# EAGLE design 3.3-5V Signal (EAGLE 9.6.2)
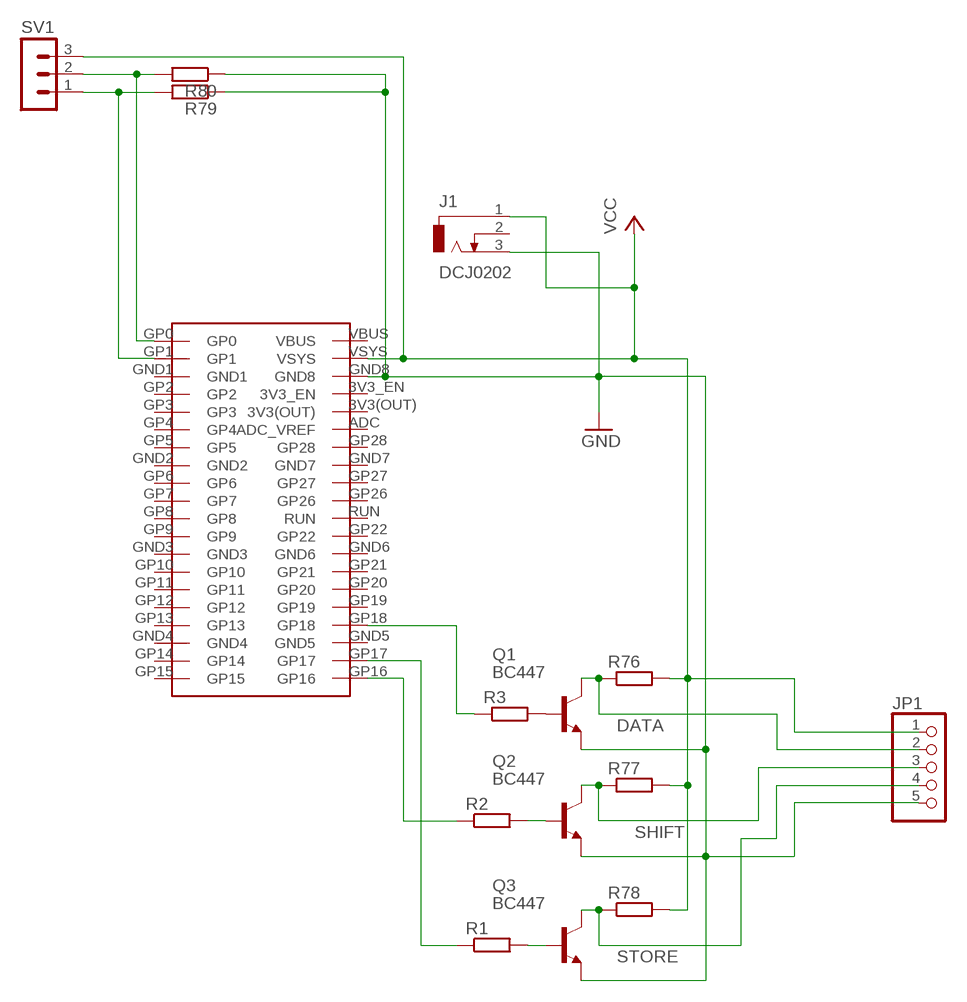
[diagram p0: schematic, sheet 1]

## Parts
J1  DCJ0202  [DCJ0202]
JP1  PINHD-1X5  [1X05]
Q1  BC447  [TO92-EBC]
Q2  BC447  [TO92-EBC]
Q3  BC447  [TO92-EBC]
R1  R-EU_0207/10  [0207/10]
R2  R-EU_0207/10  [0207/10]
R3  R-EU_0207/10  [0207/10]
R76  R-EU_0207/10  [0207/10]
R77  R-EU_0207/10  [0207/10]
R78  R-EU_0207/10  [0207/10]
R79  R-EU_0207/10  [0207/10]
R80  R-EU_0207/10  [0207/10]
SV1  MA03-1  [MA03-1]
U$2  PI_PICO  [PI_PICO]

## Nets
DATA: JP1.2 Q1.C R76.1
GND: J1.3 JP1.5 Q1.E Q2.E Q3.E R79.1 R80.1 U$2.GND8
N$1: R1.1 U$2.GP17
N$2: Q3.B R1.2
N$4: Q2.B R2.2
N$5: Q1.B R3.2
N$6: R3.1 U$2.GP18
N$7: R2.1 U$2.GP16
N$41: R80.2 SV1.2 U$2.GP0
N$43: R79.2 SV1.1 U$2.GP1
SHIFT: JP1.3 Q2.C R77.1
STORE: JP1.4 Q3.C R78.1
VCC: J1.1 JP1.1 R76.2 R77.2 R78.2 SV1.3 U$2.VSYS
Unconnected: J1.2 U$2.3V3(OUT) U$2.3V3_EN U$2.ADC(ADC_VREF) U$2.GND1 U$2.GND2 U$2.GND3 U$2.GND4 U$2.GND5 U$2.GND6 U$2.GND7 U$2.GP2 U$2.GP3 U$2.GP4 U$2.GP5 U$2.GP6 U$2.GP7 U$2.GP8 U$2.GP9 U$2.GP10 U$2.GP11 U$2.GP12 U$2.GP13 U$2.GP14 U$2.GP15 U$2.GP19 U$2.GP20 U$2.GP21 U$2.GP22 U$2.GP26 U$2.GP27 U$2.GP28 U$2.RUN U$2.VBUS

## Library data of the parts
J1 = con-jack:DCJ0202: DC POWER JACK Source: DCJ0202.pdf; OC_FARNELL: unknown; OC_NEWARK: unknown
JP1 = pinhead:PINHD-1X5: PIN HEADER
Q1-Q3 = transistor-npn:BC447*: NPN Transistor
R1-R3 R76-R80 = rcl:R-EU_: RESISTOR, European symbol; SPICEPREFIX: R
SV1 = con-lstb:MA03-1: PIN HEADER; OC_FARNELL: unknown; OC_NEWARK: unknown
U$2 = PI_PICO:PI_PICO

## Board
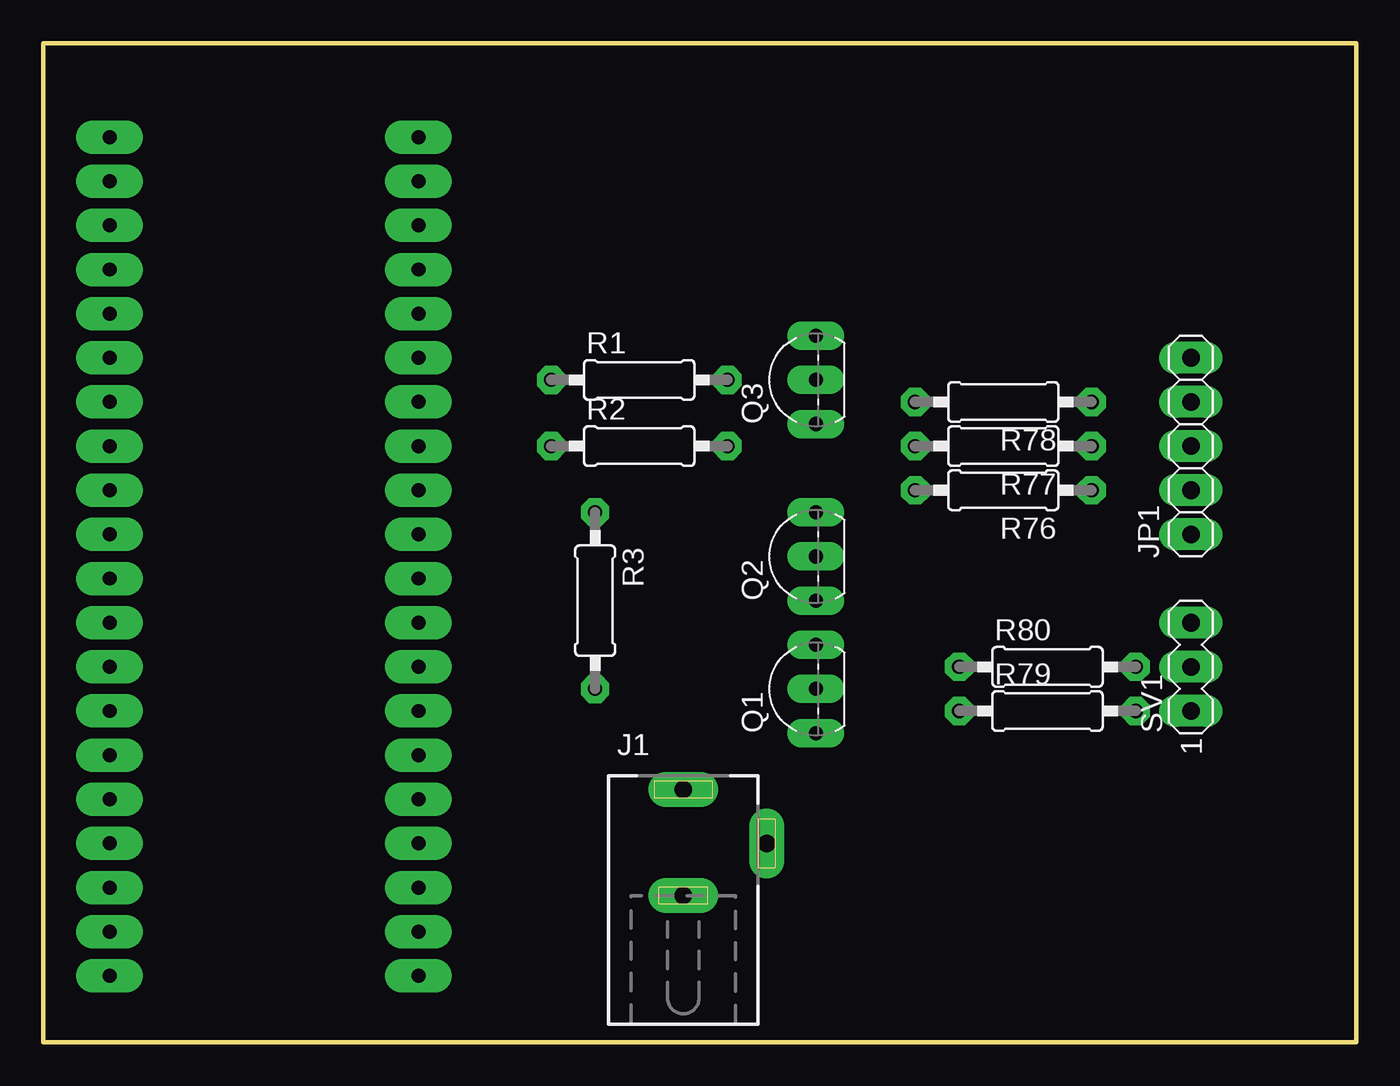
[diagram p1: board, top side]
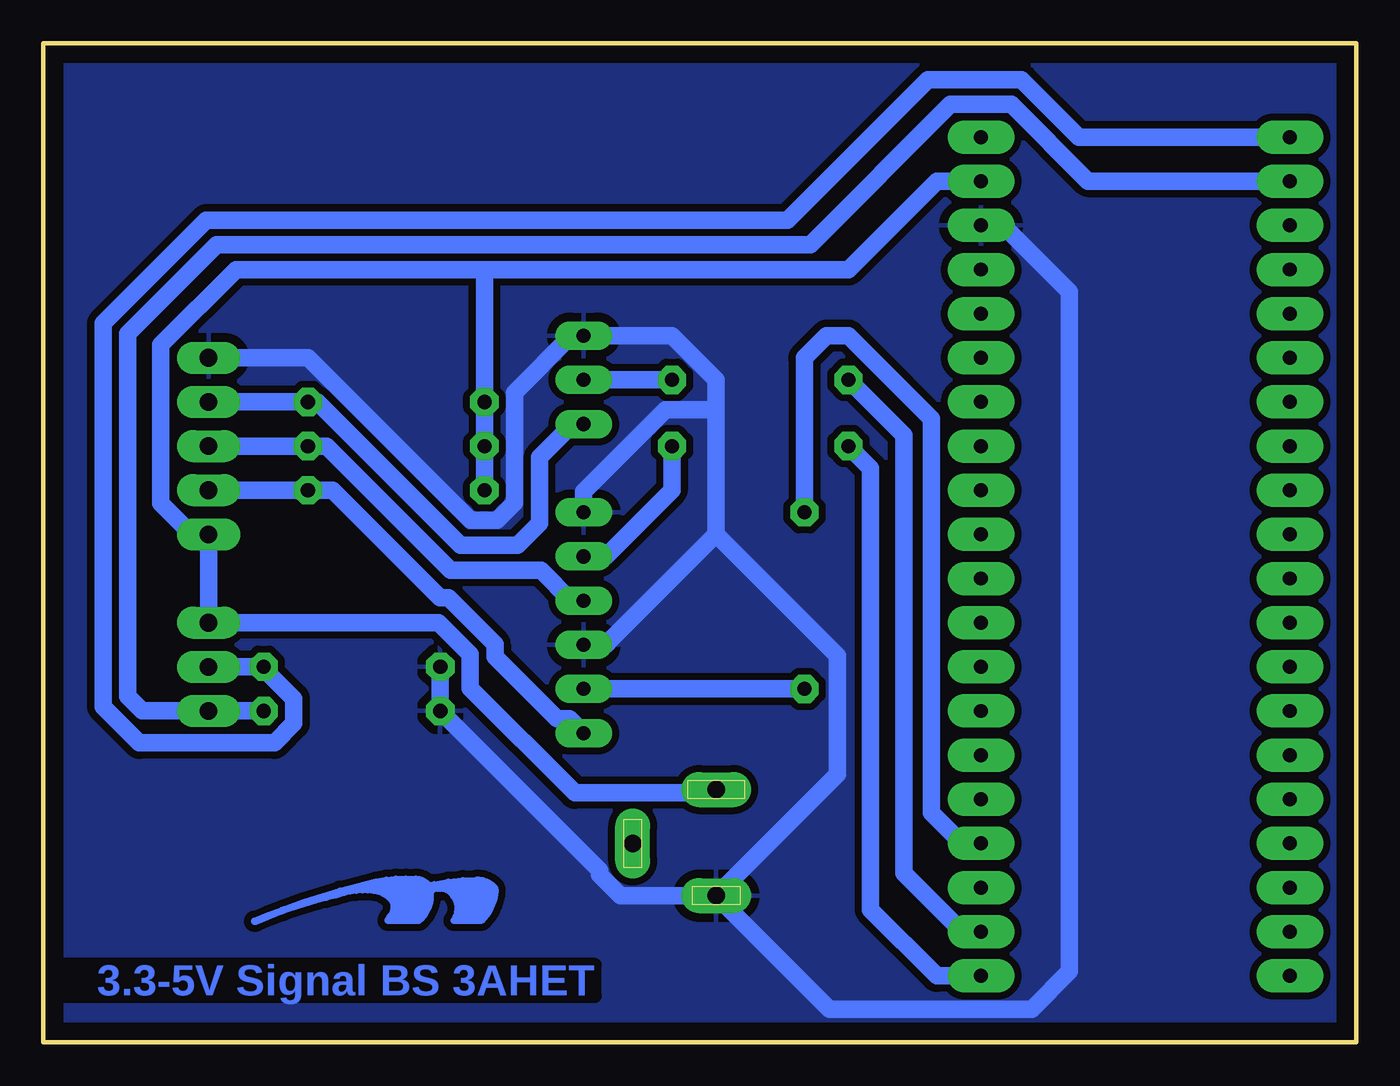
[diagram p2: board, bottom side, seen from below]

Size 75.55 x 57.45 mm. Coordinates in mm from the lower left corner, seen from the top.
Outline: 0,0 75.55,0 75.55,57.45 0,57.45 0,0
Copper layers (1*16): Top 0.035mm / dielectric 1.5mm / Bottom 0.035mm
Design rules "htl": minimum track width 16mil, minimum drill 24mil, track to track 16mil, track to pad 16mil, pad to pad 16mil, via to via 16mil, smd to smd 12mil, copper to edge 40mil, drill to drill 6mil, minimum pad ring 16mil, minimum via ring 16mil, stop-mask expansion 4mil, vias tented up to drill 0mil, thermal gap 20mil

### Footprints (pad centres in the part's own frame; a part is rotated, then mirrored left to right if it is on the bottom)
DCJ0202 = drill 1 pad 2 long: 1 0,3.1; 2 4.8,0; 3 0,-3
1X05 = drill 1.016 long: 1 -5.08,0; 2 -2.54,0; 3 0,0; 4 2.54,0; 5 5.08,0
TO92-EBC = drill 0.813 long: B 0,-1.27; C -2.54,-1.27; E 2.54,-1.27
0207/10 = drill 0.813 octagon: 1 -5.08,0; 2 5.08,0
MA03-1 = drill 1.016 long: 1 -2.54,0; 2 0,0; 3 2.54,0
PI_PICO = drill 0.8 pad 1.93 long: 3V3(OUT) 7.62,15.24; 3V3_EN 7.62,17.78; ADC 7.62,12.7; GND1 -10.16,20.32; GND2 -10.16,7.62; GND3 -10.16,-5.08; GND4 -10.16,-17.78; GND5 7.62,-17.78; GND6 7.62,-5.08; GND7 7.62,7.62; GND8 7.62,20.32; GP0 -10.16,25.4; GP1 -10.16,22.86; GP2 -10.16,17.78; GP3 -10.16,15.24; GP4 -10.16,12.7; GP5 -10.16,10.16; GP6 -10.16,5.08; GP7 -10.16,2.54; GP8 -10.16,0; GP9 -10.16,-2.54; GP10 -10.16,-7.62; GP11 -10.16,-10.16; GP12 -10.16,-12.7; GP13 -10.16,-15.24; GP14 -10.16,-20.32; GP15 -10.16,-22.86; GP16 7.62,-22.86; GP17 7.62,-20.32; GP18 7.62,-15.24; GP19 7.62,-12.7; GP20 7.62,-10.16; GP21 7.62,-7.62; GP22 7.62,-2.54; GP26 7.62,2.54; GP27 7.62,5.08; GP28 7.62,10.16; RUN 7.62,0; VBUS 7.62,25.4; VSYS 7.62,22.86

### Placement (x,y rotation side)
J1  36.83,11.43 0 top
JP1  66.04,34.29 90 top
Q1  43.18,20.32 90 top
Q2  43.18,27.94 90 top
Q3  43.18,38.1 90 top
R1  34.29,38.1 0 top
R2  34.29,34.29 0 top
R3  31.75,25.4 270 top
R76  55.24,31.75 180 top
R77  55.24,34.29 180 top
R78  55.24,36.83 180 top
R79  57.78,19.05 0 top
R80  57.78,21.59 0 top
SV1  66.04,21.59 90 top
U$2  13.97,26.67 0 top
U$3  [LOGOBOT_15]  54.61,6.99 0 top

### Tracks (layer width: path | path; a pad name or v marks a point on that pad's centre or on a via)
DATA
  Bottom 1.016: JP1.2 R76.1 58.9,31.75 52.7,25.55 52.21,25.55 49.55,22.89 49.55,22.17 45.98,18.59 45.26,18.59 Q1.C
GND
  Bottom 1.016: J1.3 30.3,1.91 18.67,1.91 16.51,4.06 16.51,43.18 20.32,46.99 U$2.GND8 | Q1.E 43.18,22.86 42.81,23.23 36.83,29.21 | 36.83,29.21 36.83,36.2 | 36.83,36.2 36.83,38.1 39.37,40.64 Q3.E 45.16,40.64 48.44,37.37 48.44,31.04 49.45,30.02 50.97,30.02 60.32,39.37 JP1.5 | 36.83,36.2 37.01,36.37 39.73,36.37 44.45,31.65 Q2.E | J1.3 29.84,15.41 29.84,22.23 36.83,29.21 | J1.3 42.34,8.43 43.54,9.64 43.54,9.89 R79.1 R80.1
  pour Bottom: 0.64,57.15 74.93,57.15 74.93,0 0.64,0
N$1
  Bottom 1.016: U$2.GP17 21.61,6.38 22.7,6.38 26.04,9.71 26.04,34.92 R1.1
N$2
  Bottom 1.016: Q3.B R1.2
N$4
  Bottom 1.016: R2.2 39.37,31.75 43.18,27.94 Q2.B
N$5
  Bottom 1.016: Q1.B R3.2
N$6
  Bottom 1.016: U$2.GP18 21.61,11.46 22.7,11.46 24.43,13.19 24.43,35.87 29.21,40.64 30.48,40.64 31.75,39.37 R3.1
N$7
  Bottom 1.016: U$2.GP16 24.13,3.81 27.94,7.62 27.94,33.02 R2.1
N$41
  Bottom 1.016: U$2.GP0 15.96,52.07 19.26,55.37 24.64,55.37 32.72,47.3 66.17,47.3 72.11,41.35 72.11,19.3 70.03,17.22 62.25,17.22 61.14,18.34 61.14,19.77 62.87,21.49 R80.2 SV1.2
N$43
  Bottom 1.016: U$2.GP1 15.43,49.53 19.85,53.95 23.33,53.95 31.41,45.87 65.58,45.87 70.69,40.76 70.69,19.89 69.85,19.05 SV1.1 R79.2
SHIFT
  Bottom 1.016: Q2.C 45.16,25.4 46.92,27.15 52.12,27.15 59.26,34.29 R77.1 JP1.3
STORE
  Bottom 1.016: JP1.4 R78.1 59.79,36.83 51.53,28.57 48.26,28.57 46.99,29.84 46.99,33.66 45.09,35.56 Q3.C
VCC
  Bottom 1.016: R76.2 R77.2 R78.2 50.16,44.45 | U$2.VSYS 24.13,49.53 29.21,44.45 50.16,44.45 | J1.1 37.02,14.34 44.96,14.34 50.98,20.36 50.98,22.3 52.8,24.13 SV1.3 JP1.1 67,29.21 68.78,30.99 68.78,40.13 64.46,44.45 50.16,44.45

### Text on the board
Bottom: 3.3-5V Signal BS 3AHET